# EAGLE design T06_preliminarySchematic_v4 (EAGLE 7.3.0)
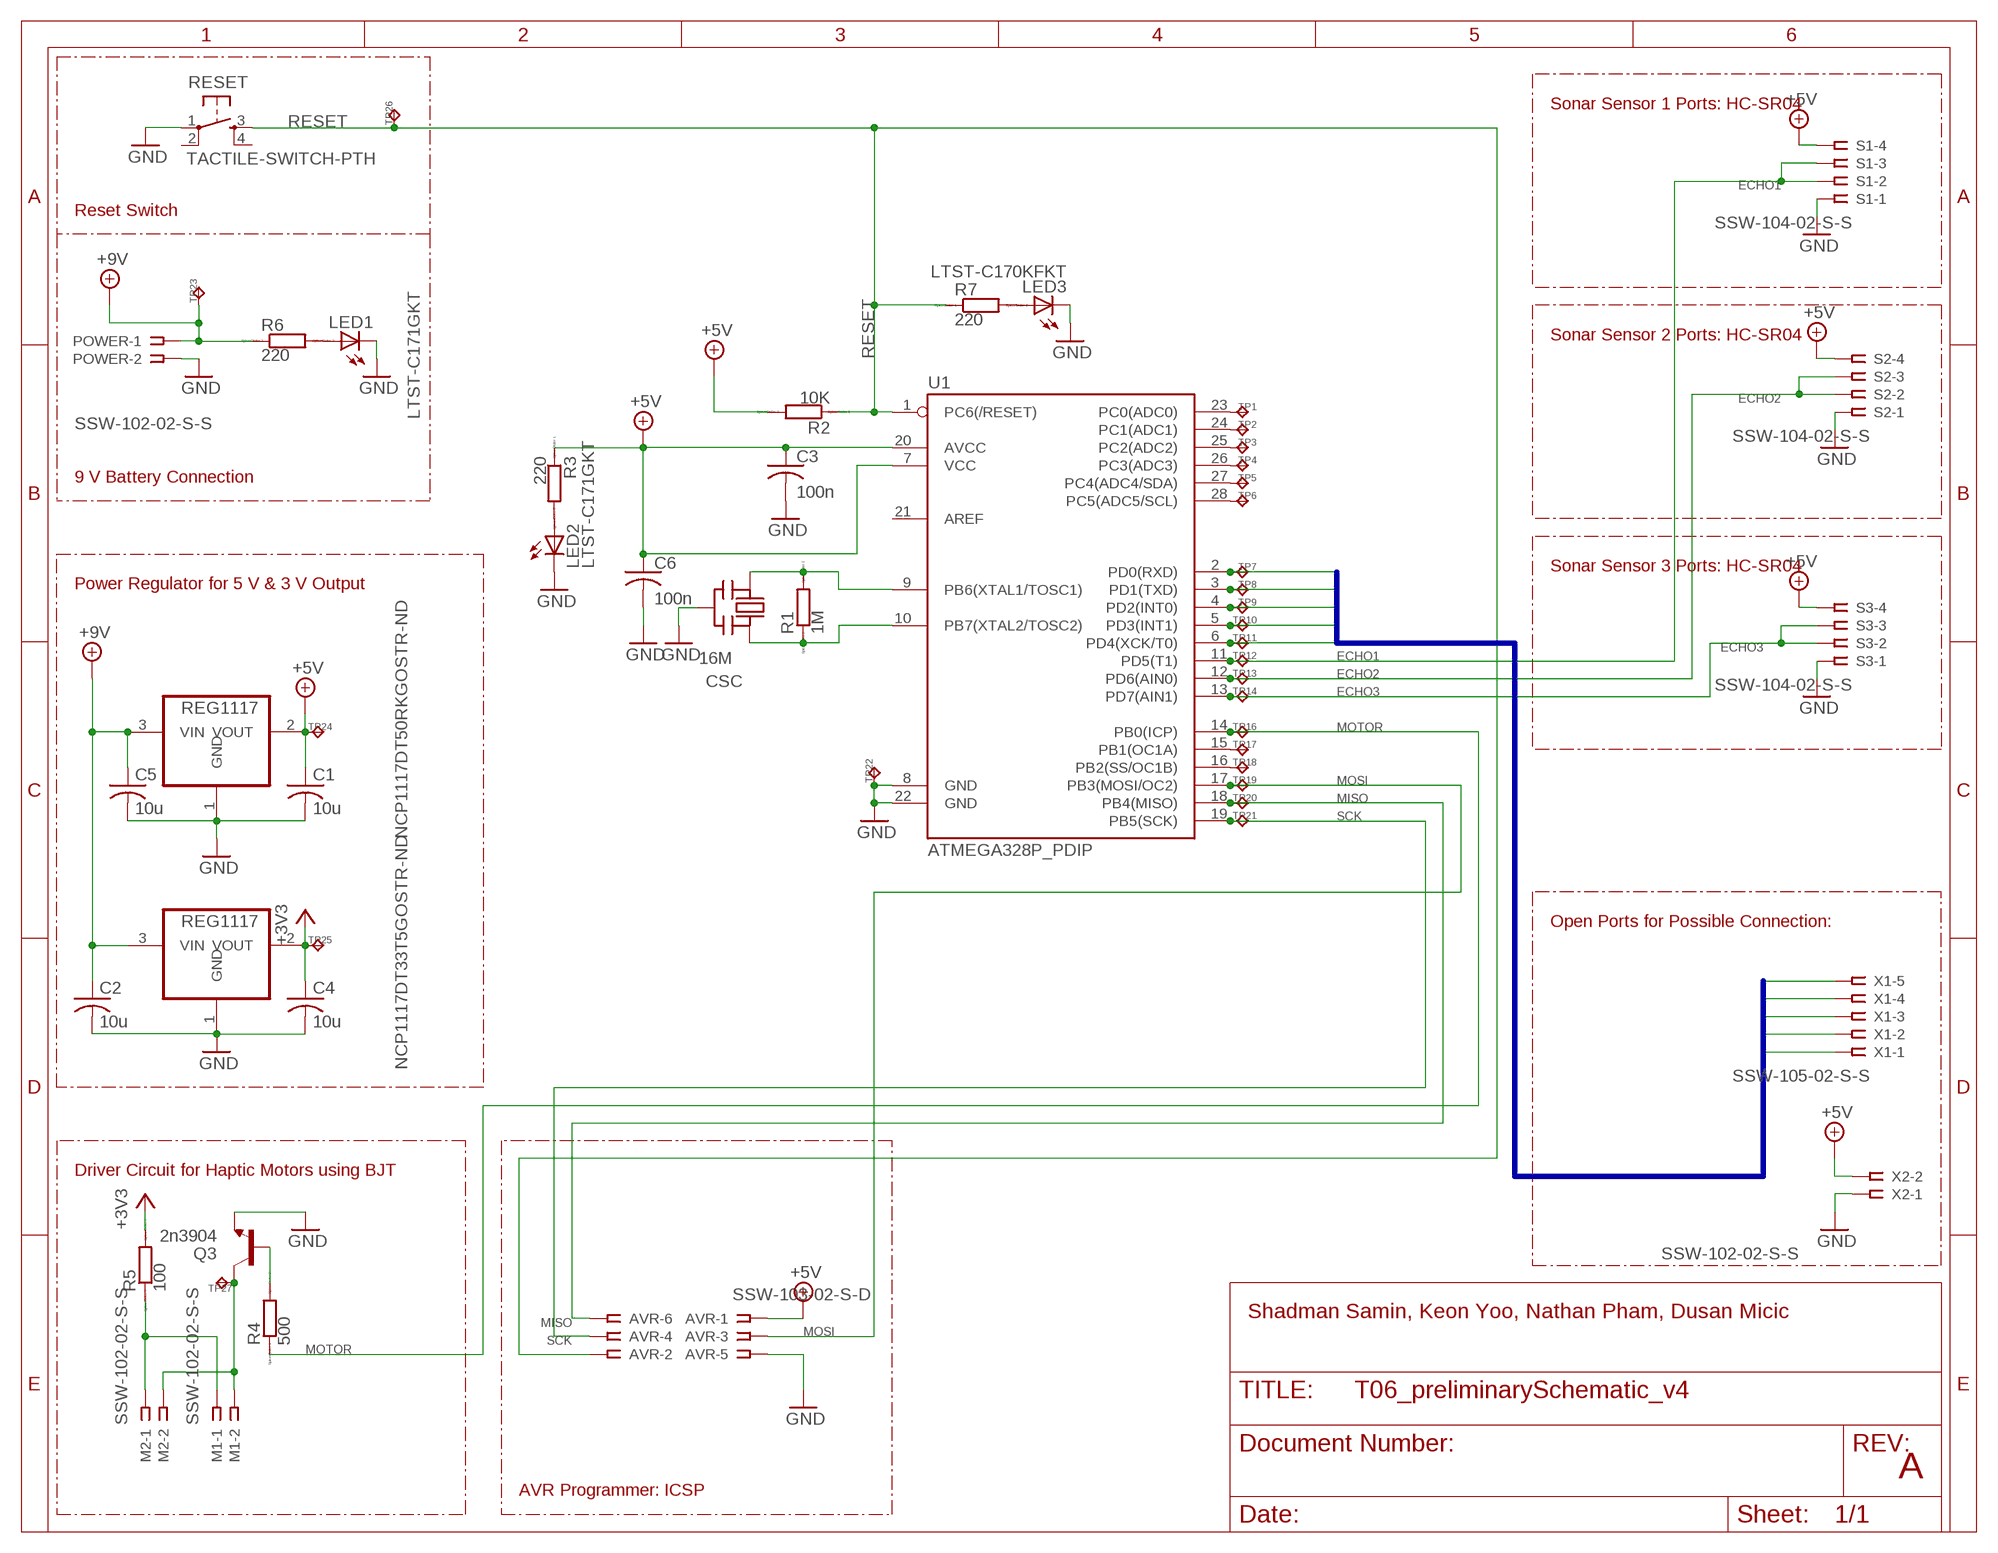
[diagram p0: schematic, sheet 1]

## Parts
AVR  SSW-103-02-S-D  [SSW-103-02-S-D]
C1  10u  C-USC0805K  [C0805K]
C2  10u  C-USC0805K  [C0805K]
C3  100n  C-USC0805K  [C0805K]
C4  10u  C-USC0805K  [C0805K]
C5  10u  C-USC0805K  [C0805K]
C6  100n  C-USC0805K  [C0805K]
CSC  16M  CERMOSCILL-CSTCRG  [CSTCR-G]
LED1  LTST-C171GKT  LEDCHIPLED_0805  [CHIPLED_0805]
LED2  LTST-C171GKT  LEDCHIP-LED0805  [CHIP-LED0805]
LED3  LTST-C170KFKT  LEDCHIP-LED0805  [CHIP-LED0805]
M1  SSW-102-02-S-S  [SSW-102-02-S-S]
M2  SSW-102-02-S-S  [SSW-102-02-S-S]
NCP1117DT33T5GOSTR-ND  REG1117  [SOT223]
NCP1117DT50RKGOSTR-ND  REG1117  [SOT223]
POWER  SSW-102-02-S-S  [SSW-102-02-S-S]
Q3  2n3904  TRANSISTOR_NPN2N3904  [TO-92]
R1  1M  RR0603  [R0603]
R2  10K  RR0603  [R0603]
R3  220  RR0603  [R0603]
R4  500  RR0603  [R0603]
R5  100  RR0603  [R0603]
R6  220  RR0603  [R0603]
R7  220  RR0603  [R0603]
RESET  TACTILE-SWITCH-PTH  [TAC-SWITCH-PTH]
S1  SSW-104-02-S-S  [SSW-104-02-S-S]
S2  SSW-104-02-S-S  [SSW-104-02-S-S]
S3  SSW-104-02-S-S  [SSW-104-02-S-S]
TP1  TPPAD1-13  [P1-13]
TP2  TPPAD1-13  [P1-13]
TP3  TPPAD1-13  [P1-13]
TP4  TPPAD1-13  [P1-13]
TP5  TPPAD1-13  [P1-13]
TP6  TPPAD1-13  [P1-13]
TP7  TPPAD1-13  [P1-13]
TP8  TPPAD1-13  [P1-13]
TP9  TPPAD1-13  [P1-13]
TP10  TPPAD1-13  [P1-13]
TP11  TPPAD1-13  [P1-13]
TP12  TPPAD1-13  [P1-13]
TP13  TPPAD1-13  [P1-13]
TP14  TPPAD1-13  [P1-13]
TP16  TPPAD1-13  [P1-13]
TP17  TPPAD1-13  [P1-13]
TP18  TPPAD1-13  [P1-13]
TP19  TPPAD1-13  [P1-13]
TP20  TPPAD1-13  [P1-13]
TP21  TPPAD1-13  [P1-13]
TP22  TPPAD1-13  [P1-13]
TP23  TPPAD1-13  [P1-13]
TP24  TPPAD1-13  [P1-13]
TP25  TPPAD1-13  [P1-13]
TP26  TPPAD1-13  [P1-13]
TP27  TPPAD1-13  [P1-13]
U1  ATMEGA328P_PDIP  [DIL28-3]
X1  SSW-105-02-S-S  [SSW-105-02-S-S]
X2  SSW-102-02-S-S  [SSW-102-02-S-S]

## Nets
+3V3: C4.1 NCP1117DT33T5GOSTR-ND.2(VOUT) R5.2 TP25.TP
+5V: AVR.1 C1.1 C3.1 C6.1 NCP1117DT50RKGOSTR-ND.2(VOUT) R2.2 R3.1 S1.4 S2.4 S3.4 TP24.TP U1.7(VCC) U1.20(AVCC) X2.2
+9V: C2.1 C5.1 NCP1117DT33T5GOSTR-ND.3(VIN) NCP1117DT50RKGOSTR-ND.3(VIN) POWER.1 R6.1 TP23.TP
BU0: TP7.TP U1.2(PD0(RXD)) X1.1
BU1: TP8.TP U1.3(PD1(TXD)) X1.2
BU2: TP9.TP U1.4(PD2(INT0)) X1.3
BU3: TP10.TP U1.5(PD3(INT1)) X1.4
BU4: TP11.TP U1.6(PD4(XCK/T0)) X1.5
D16: TP18.TP U1.16(PB2(SS/OC1B))
ECHO1: S1.2 S1.3 TP12.TP U1.11(PD5(T1))
ECHO2: S2.2 S2.3 TP13.TP U1.12(PD6(AIN0))
ECHO3: S3.2 S3.3 TP14.TP U1.13(PD7(AIN1))
GND: AVR.5 C1.2 C2.2 C3.2 C4.2 C5.2 C6.2 CSC.2(GND) LED1.C LED2.C LED3.C NCP1117DT33T5GOSTR-ND.1(GND) NCP1117DT50RKGOSTR-ND.1(GND) POWER.2 Q3.1(E) RESET.1 S1.1 S2.1 S3.1 TP22.TP U1.8(GND) U1.22(GND) X2.1
MISO: AVR.6 TP20.TP U1.18(PB4(MISO))
MOSI: AVR.3 TP19.TP U1.17(PB3(MOSI/OC2))
MOTOR: R4.1 TP16.TP U1.14(PB0(ICP))
N$1: CSC.3(OUT) R1.1 U1.10(PB7(XTAL2/TOSC2))
N$2: CSC.1(IN) R1.2 U1.9(PB6(XTAL1/TOSC1))
N$3: TP1.TP U1.23(PC0(ADC0))
N$4: TP2.TP U1.24(PC1(ADC1))
N$5: M1.1 M2.1 R5.1
N$6: TP3.TP U1.25(PC2(ADC2))
N$7: LED1.A R6.2
N$8: LED2.A R3.2
N$9: LED3.A R7.2
N$10: Q3.2(B) R4.2
N$11: M1.2 M2.2 Q3.3(C) TP27.TP
N$12: TP4.TP U1.26(PC3(ADC3))
N$13: TP5.TP U1.27(PC4(ADC4/SDA))
N$14: TP6.TP U1.28(PC5(ADC5/SCL))
N$15: TP17.TP U1.15(PB1(OC1A))
RESET: AVR.2 R2.1 R7.1 RESET.3 TP26.TP U1.1(PC6(/RESET))
SCK: AVR.4 TP21.TP U1.19(PB5(SCK))
Unconnected: RESET.2 RESET.4 U1.21(AREF)

## Buses
BU[0..4]

## Notes on the sheet
- Sonar Sensor 1 Ports: HC-SR04
- Reset Switch
- Sonar Sensor 2 Ports: HC-SR04
- 9 V Battery Connection
- Sonar Sensor 3 Ports: HC-SR04
- Power Regulator for 5 V & 3 V Output
- Open Ports for Possible Connection:
- Driver Circuit for Haptic Motors using BJT
- Shadman Samin, Keon Yoo, Nathan Pham, Dusan Micic
- A
- AVR Programmer: ICSP

## Library data of the parts
AVR = con-samtec:SSW-103-02-S-D: THROUGH-HOLE .025" SQ POST SOCKET Source: Samtec SSW.pdf; MPN: SSW-103-02-S-D; OC_FARNELL: unknown; OC_NEWARK: 11P9365
C1 C2 C4 C5 = adafruit:C-US: CAPACITOR, American symbol
C3 C6 = rcl:C-US: CAPACITOR, American symbol
CSC = adafruit:CERMOSCILL: Ceramic oscillator with built in capacitors such as ZTT-12MHz http://www.ladyada.net/library/eagle
LED1-LED3 = adafruit:LED: LED OSRAM: - CHIPLED LG R971, LG N971, LY N971, LG Q971, LY Q971, LO R971, LY R971 LH N974, LH R974 LS Q976, LO Q976, LY Q976 LO Q996 - Hyper CHIPLED LW Q18S LB Q993, LB Q99A, LB R99A - SideLED LS A670, LO A670, LY A670, LG A670, LP A670 LB A673, LV A673, LT A673, LW A673 LH A674 LY A675 LS A676, LA A676, LO A676, LY A676, LW A676 LS A679, LY A679, LG A679 - Hyper Micro SIDELED® LS Y876, LA Y876, LO Y876, LY Y876 LT Y87S - SmartLED LW L88C, LW L88S LB L89C, LB L89S, LG L890 LS L89K, LO L89K, LY L89K LS L896, LA L896, LO L896, LY L896 - TOPLED LS T670, LO T670, LY T670, LG T670, LP T670 LSG T670, LSP T670, LSY T670, LOP T670, LYG T670 LG T671, LOG T671, LSG T671 LB T673, LV T673, LT T673, LW T673 LH T674 LS T676, LA T676, LO T676, LY T676, LB T676, LH T676, LSB T676, LW T676 LB T67C, LV T67C, LT T67C, LS T67K, LO T67K, LY T67K, LW E67C LS E67B, LA E67B, LO E67B, LY E67B, LB E67C, LV E67C, LT E67C LW T67C LS T679, LY T679, LG T679 LS T770, LO T770, LY T770, LG T770, LP T770 LB T773, LV T773, LT T773, LW T773 LH T774 LS E675, LA E675, LY E675, LS T675 LS T776, LA T776, LO T776, LY T776, LB T776 LHGB T686 LT T68C, LB T68C - Hyper Mini TOPLED® LB M676 - Mini TOPLED Santana® LG M470 LS M47K, LO M47K, LY M47K Source: http://www.osram.convergy.de/
M1 M2 POWER X2 = con-samtec:SSW-102-02-S-S: THROUGH-HOLE .025" SQ POST SOCKET Source: Samtec SSW.pdf; MPN: SSW-102-02-S-S; OC_FARNELL: unknown; OC_NEWARK: 11P9351
NCP1117DT33T5GOSTR-ND NCP1117DT50RKGOSTR-ND = burr-brown:REG1117: 800mA and 1A Low Dropout (LDO) Positive Regulator 1.8V, 2.5V, 2.85V, 3.3V, 5V, and Adj; MPN: REG1117; OC_FARNELL: 1097566; OC_NEWARK: 14P6981
Q3 = SparkFun-DiscreteSemi:TRANSISTOR_NPN: Generic NPN BJT MMBT2222A - TRANS-08049 (SOT-23, 1A 40V) MPSA42 - TRANS-09116 (SOT-23, 500mA 300V) MMBT5088LT1G - TRANS-11160 (SOT-23, 50 mA 30V) BC547 - COM-08928 <http://www.sparkfun.com/products/8928> (TO-92 45V 100mA) (1.Collector 2.Base 3.Emitter) 2N3904 - COM-00521 <http://www.sparkfun.com/products/521> (TO-92 40V 200mA) (1.Emitter 2.Base 3.Collector) P2N2222A - COM-12852 <http://www.sparkfun.com/products/12852> (TO-92 40V 600mA) (1.Collector 2.Base 3.Emitter); PROD_ID: TRANS-08447
R1-R7 = eagle-ltspice:R: RESISTOR, European symbol; SPICEMODEL: NONE; SPICEPREFIX: R
RESET = GeekAmmo:TACTILE-SWITCH: Tactile Switch 4 Pins, SPST NO
S1-S3 = con-samtec:SSW-104-02-S-S: THROUGH-HOLE .025" SQ POST SOCKET Source: Samtec SSW.pdf; MPN: SSW-104-02-S-S; OC_FARNELL: unknown; OC_NEWARK: 11P9384
TP1-TP14 TP16-TP27 = testpad:TP: Test pad
U1 = SparkFun-DigitalIC:ATMEGA328P_PDIP: uC used in the Arduino 32kb flash, 1k EEPROM, 2k SRAM This is the through-hole version of this chip.
X1 = con-samtec:SSW-105-02-S-S: THROUGH-HOLE .025" SQ POST SOCKET Source: Samtec SSW.pdf; MPN: SSW-105-02-S-S; OC_FARNELL: unknown; OC_NEWARK: 11P9399

## Net classes
0 default: width 0.305 mm, drill 0.508 mm, clearance 0.254 mm

## Board
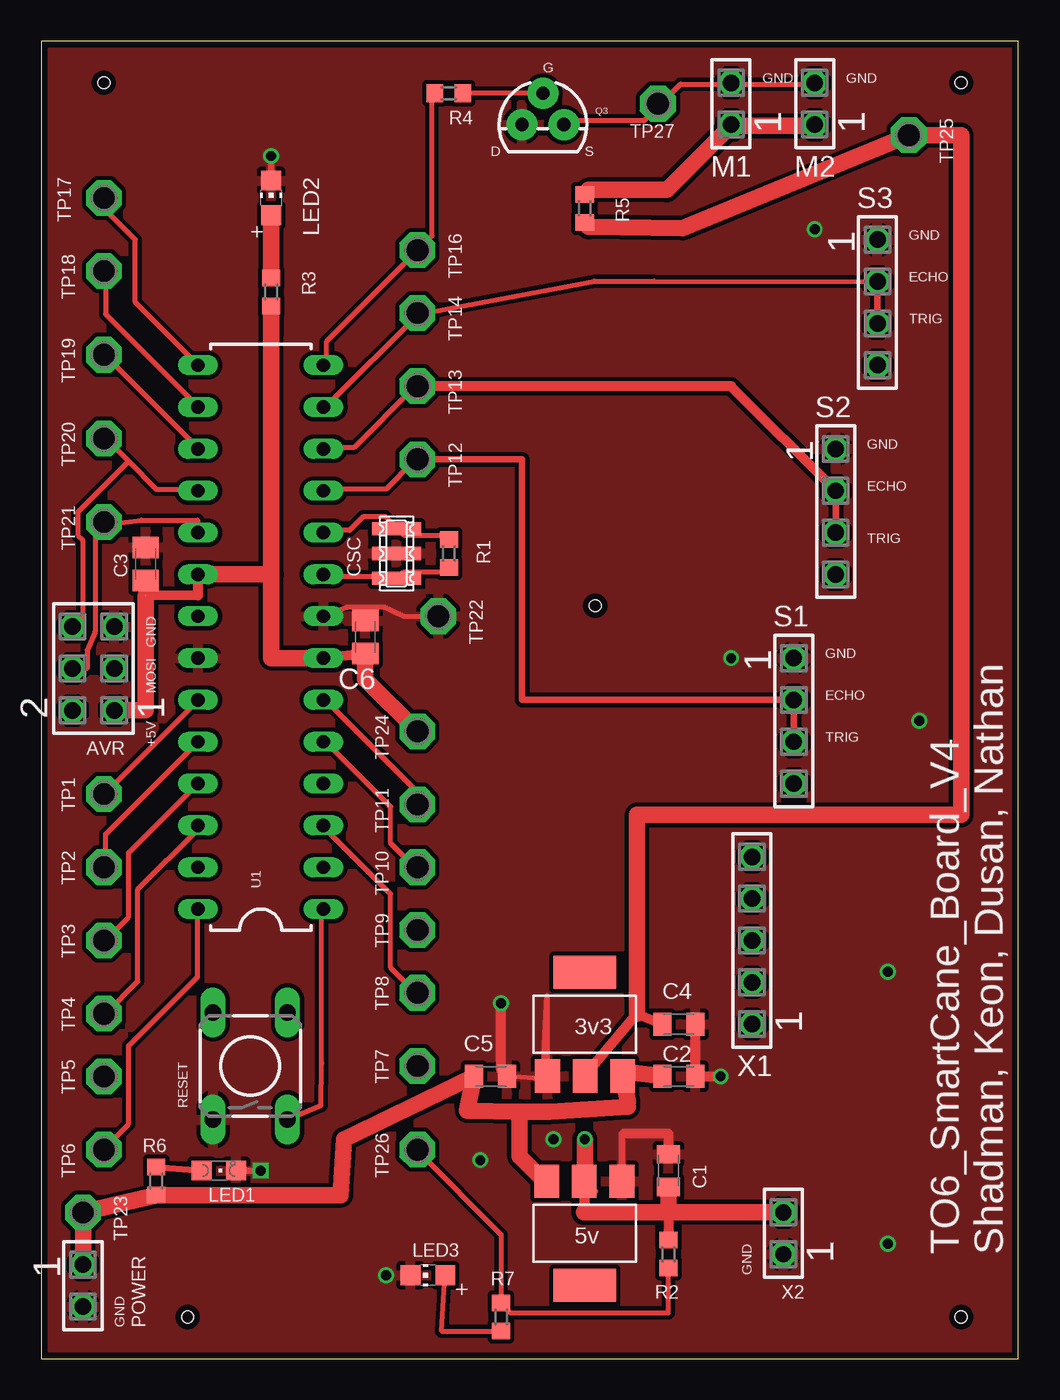
[diagram p1: board, top side]
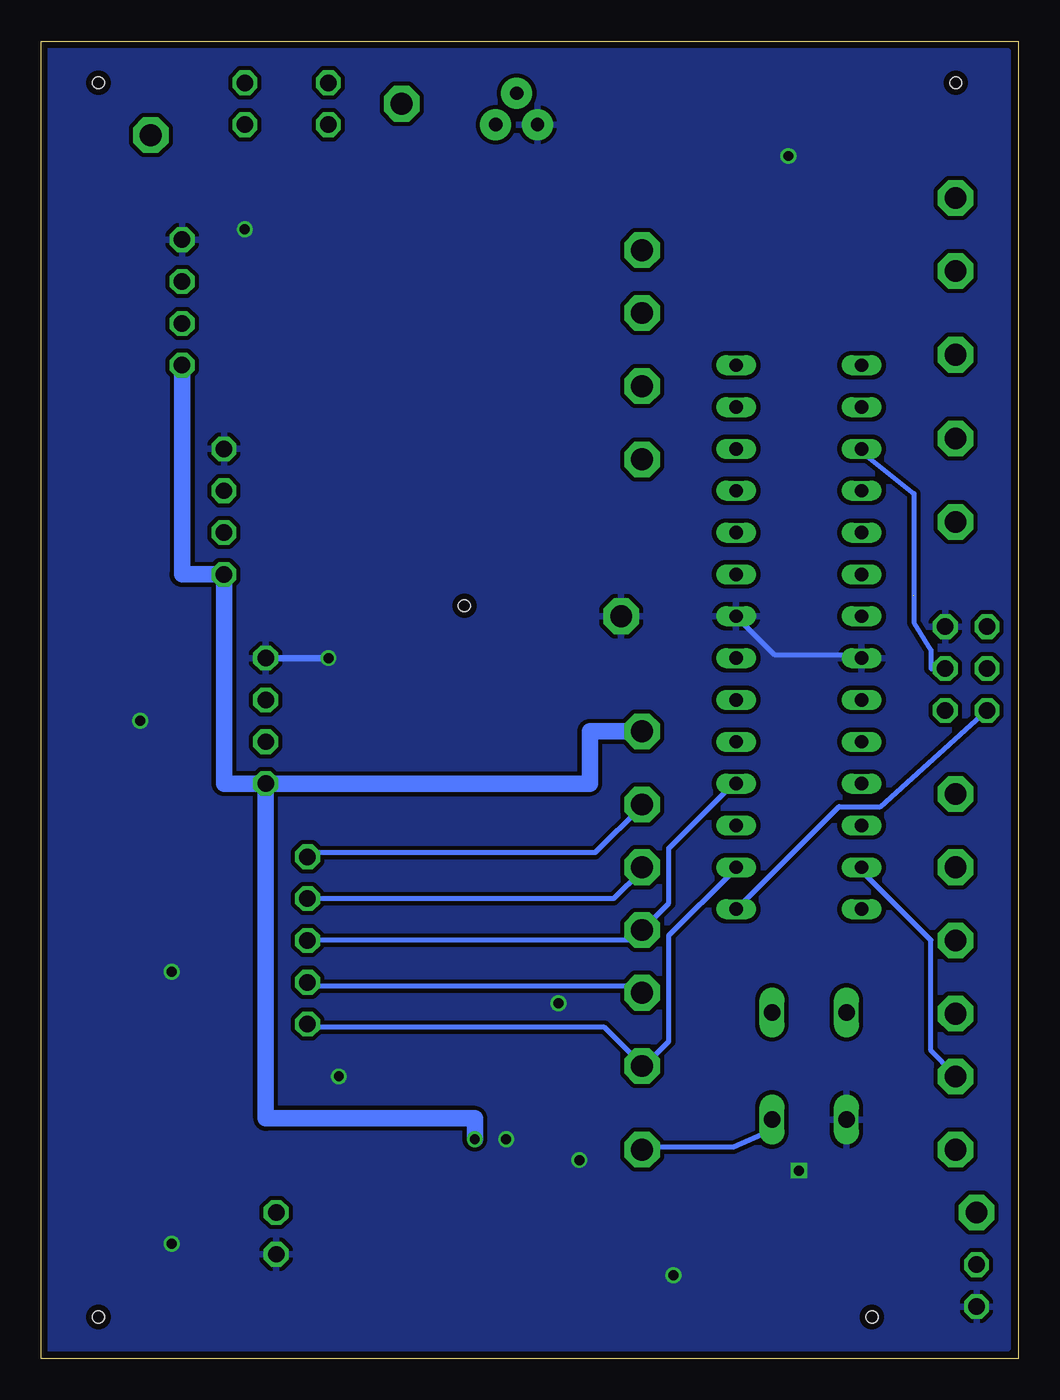
[diagram p2: board, bottom side, seen from below]

Size 59.36 x 80 mm. Coordinates in mm from the lower left corner, seen from the top.
Outline: 0,0 59.36,0 59.36,80 0,80 0,0
Copper layers (1*16): Top 0.0356mm / dielectric 1.5011mm / Bottom 0.0356mm
Design rules "LaenPCBOrder": minimum track width 6mil, minimum drill 13mil, track to track 6mil, track to pad 6mil, pad to pad 6mil, via to via 6mil, smd to smd 6mil, copper to edge 15mil, drill to drill 6mil, minimum pad ring 7mil, minimum via ring 7mil, stop-mask expansion 3mil, vias tented up to drill 0mil, thermal gap 10mil
Holes 0.7 mm at 55.88,2.54 8.89,2.54 3.81,77.47 55.88,77.47 33.66,45.72

### Footprints (pad centres in the part's own frame; a part is rotated, then mirrored left to right if it is on the bottom)
SSW-103-02-S-D = drill 1 pad 1.5 octagon: 1 -2.54,-1.27; 2 -2.54,1.27; 3 0,-1.27; 4 0,1.27; 5 2.54,-1.27; 6 2.54,1.27
C0805K = smd 1.1 x 1.4: 1 -1,0; 2 1,0
C0805K' = smd 1.3 x 1.6: 1 -1,0; 2 1,0
CSTCR-G = smd 0.8 x 3: 1 -1.5,0; 2 0,0; 3 1.5,0
CHIPLED_0805 = smd 1.2 x 1.2: A 0,-1.05; C 0,1.05
CHIP-LED0805 = smd 1.2 x 1.2: A 0,-1.05; C 0,1.05
SSW-102-02-S-S = drill 1 pad 1.5 octagon: 1 -1.27,0; 2 1.27,0
SOT223 = smd 1.499 x 2.007: 1 -2.261,-3.15; 2 0.025,-3.15; 3 2.311,-3.15 | smd 3.81 x 2.007: 4 0,3.15
TO-92 = drill 0.813 pad 1.88: 1 -1.27,0; 2 0,1.905; 3 1.27,0
R0603 = smd 1 x 1.1: 1 -0.85,0; 2 0.85,0
TAC-SWITCH-PTH = drill 1.016 pad 1.524 long: 1 -3.251,2.261; 2 3.251,2.261; 3 -3.251,-2.261; 4 3.251,-2.261
SSW-104-02-S-S = drill 1 pad 1.5 octagon: 1 -3.81,0; 2 -1.27,0; 3 1.27,0; 4 3.81,0
P1-13 = drill 1.321 pad 2.159 octagon: TP 0,0
DIL28-3 = drill 0.813 long: 1 -16.51,-3.81; 2 -13.97,-3.81; 3 -11.43,-3.81; 4 -8.89,-3.81; 5 -6.35,-3.81; 6 -3.81,-3.81; 7 -1.27,-3.81; 8 1.27,-3.81; 9 3.81,-3.81; 10 6.35,-3.81; 11 8.89,-3.81; 12 11.43,-3.81; 13 13.97,-3.81; 14 16.51,-3.81; 15 16.51,3.81; 16 13.97,3.81; 17 11.43,3.81; 18 8.89,3.81; 19 6.35,3.81; 20 3.81,3.81; 21 1.27,3.81; 22 -1.27,3.81; 23 -3.81,3.81; 24 -6.35,3.81; 25 -8.89,3.81; 26 -11.43,3.81; 27 -13.97,3.81; 28 -16.51,3.81
SSW-105-02-S-S = drill 1 pad 1.5 octagon: 1 -5.08,0; 2 -2.54,0; 3 0,0; 4 2.54,0; 5 5.08,0

### Placement (x,y rotation side)
AVR  3.17,41.91 90 top
C1  38.1,11.43 90 top
C2  38.73,17.14 0 top
C3  100n  [C0805K']  6.35,48.26 90 top
C4  38.73,20.32 0 top
C5  27.3,17.14 0 top
C6  100n  [C0805K']  19.68,43.81 90 top
CSC  21.59,48.9 90 top
LED1  10.79,11.43 270 top
LED2  13.97,70.48 0 top
LED3  23.5,5.08 90 top
M1  41.91,76.2 90 top
M2  46.99,76.2 90 top
NCP1117DT33T5GOSTR-ND  33.02,20.32 0 top
NCP1117DT50RKGOSTR-ND  33.02,7.62 180 top
POWER  2.54,4.45 270 top
Q3  30.48,74.93 0 top
R1  24.77,48.9 270 top
R2  38.1,6.35 90 top
R3  13.97,64.77 90 top
R4  24.77,76.83 0 top
R5  33.02,69.85 270 top
R6  6.99,10.79 90 top
R7  27.94,2.54 270 top
RESET  12.7,17.78 90 top
S1  45.72,38.73 270 top
S2  48.26,51.44 270 top
S3  50.8,64.14 270 top
TP1  3.81,34.29 180 top
TP2  3.81,29.84 180 top
TP3  3.81,25.4 180 top
TP4  3.81,20.95 180 top
TP5  3.81,17.14 180 top
TP6  3.81,12.7 180 top
TP7  22.86,17.78 180 top
TP8  22.86,22.23 180 top
TP9  22.86,26.04 180 top
TP10  22.86,29.84 180 top
TP11  22.86,33.66 180 top
TP12  22.86,54.61 180 top
TP13  22.86,59.05 180 top
TP14  22.86,63.5 180 top
TP16  22.86,67.31 180 top
TP17  3.81,70.48 90 top
TP18  3.81,66.04 180 top
TP19  3.81,60.96 180 top
TP20  3.81,55.88 180 top
TP21  3.81,50.8 180 top
TP22  24.13,45.09 180 top
TP23  2.54,8.89 180 top
TP24  22.86,38.1 180 top
TP25  52.7,74.3 180 top
TP26  22.86,12.7 180 top
TP27  37.47,76.2 180 top
U1  13.34,43.81 90 top
X1  43.18,25.4 90 top
X2  45.09,7.62 90 top

### Tracks (layer width: path | path; a pad name or v marks a point on that pad's centre or on a via)
+3V3
  Top 0.305: 33.25,68.73 R5.2
  Top 0.61: NCP1117DT33T5GOSTR-ND.2 33.02,17.2 36.2,20.95 C4.1
  Top 1.016: 33.25,68.73 38.96,68.66 TP25.TP 55.88,74.3 55.88,33.02 36.2,33.02 36.2,20.95
+5V  (via drill 0.6 pad 0.61)  (1 unrouted)
  Top 0.305: 32.97,10.62 NCP1117DT50RKGOSTR-ND.2
  Top 0.406: 6.35,46.99 6.36,46.34 | NCP1117DT50RKGOSTR-ND.2 33.6,10.16 33.66,10.16 33.02,10.79
  Top 0.61: 38.1,8.89 R2.2 | 32.97,10.62 32.97,8.89 | NCP1117DT50RKGOSTR-ND.2 32.99,8.89 | 6.36,46.34 9.53,46.35 U1.20 | C3.1 6.35,46.99 | C6.1 U1.7
  Top 0.813: 6.35,46.35 6.36,43.19
  Top 1.016: C1.1 38.1,8.89 | 32.97,8.89 32.99,8.89 38.1,8.89 | X2.2 38.1,8.89 | 33.02,10.79 v33.02,13.34 | TP24.TP 19.68,41.27 C6.1 | U1.7 13.97,42.55 13.97,47.62 | 13.97,47.62 U1.20 | 6.36,46.34 6.35,46.33 6.35,39.37 AVR.1 | 13.97,47.62 13.97,62.23 13.97,62.87 R3.1
  Bottom 1.016: v33.02,13.34 33.02,14.61 45.72,14.61 S1.4 | S1.4 48.26,34.92 S2.4 50.8,47.62 S3.4 | S1.4 26.04,34.92 26.04,38.1 TP24.TP
+9V
  Top 0.305: 30.45,10.9 NCP1117DT50RKGOSTR-ND.3 | 35.64,15.29 35.64,15.57
  Top 0.406: NCP1117DT33T5GOSTR-ND.3 35.53,17.41
  Top 1.016: 29.06,15.01 29.06,12.29 30.45,10.9 | 29.06,15.01 25.88,15.06 C5.1 18.41,13.34 18.2,9.95 R6.1 TP23.TP POWER.1 | 35.64,15.57 NCP1117DT33T5GOSTR-ND.3 | 35.64,15.29 30.91,15.01 29.06,15.01 | 35.53,17.41 C2.1
BU0
  Bottom 0.305: U1.2 17.32,29.62 21.23,25.7 21.23,19.28 22.63,17.88 TP7.TP 22.91,17.88 25.15,20.12 43.08,20.12 X1.1
BU1
  Top 0.305: U1.3 17.32,32.13 21.23,28.22 21.23,23.75 22.63,22.35 TP8.TP
  Bottom 0.305: X1.2 43.08,22.63 23.19,22.63 22.91,22.35 TP8.TP
BU2
  Bottom 0.305: U1.4 17.32,34.92 21.23,31.01 21.23,27.66 TP9.TP 23.47,25.43 43.71,25.43 X1.3
BU3
  Top 0.305: U1.5 17.32,37.44 21.23,33.53 21.23,31.29 22.63,29.9 TP10.TP
  Bottom 0.305: X1.4 24.59,27.94 22.91,29.62 TP10.TP
BU4
  Top 0.305: U1.6 17.32,39.95 22.63,34.65 22.63,33.81 TP11.TP
  Bottom 0.305: X1.5 43.08,30.73 25.7,30.73 22.91,33.53 TP11.TP
D16
  Top 0.305: U1.16 9.5,57.84 3.91,63.42 3.91,65.94 TP18.TP
ECHO1
  Top 0.305: U1.11 17.32,52.81 20.95,52.81 22.63,54.48 TP12.TP
  Top 0.406: TP12.TP 29.21,54.61 29.21,40.01 S1.2 S1.3
ECHO2
  Top 0.305: U1.12 17.32,55.32 19,55.32 22.63,58.95 TP13.TP
  Top 0.406: S2.2 S2.3
  Top 0.61: S2.2 41.91,59.05 TP13.TP
ECHO3
  Top 0.305: 22.91,63.42 17.32,57.84 U1.13 | 22.91,63.42 33.6,65.43 37.24,65.43 S3.2 | 22.91,63.42 TP14.TP
  Top 0.406: S3.2 S3.3
GND  (via drill 0.6)
  Top 0.305: 35.48,10.9 NCP1117DT50RKGOSTR-ND.1 | CSC.2 20.34,48.9 | 6.4,48.74 C3.2 | 23.85,45.09 24.38,45.19 | NCP1117DT33T5GOSTR-ND.1 30.73,17.32 30.73,22.07 30.45,16.64 31.09,16.69 30.73,16.97 C5.2 | U1.8 18.59,45.62 20.83,45.62 22,45.09 23.85,45.09 | 23.85,45.09 TP22.TP
  Top 0.406: LED1.C v13.34,11.43 | LED2.C v13.97,73.03 | 35.42,13.69 35.28,13.69 NCP1117DT50RKGOSTR-ND.1
  Top 0.61: 35.42,13.69 38.1,13.69 C1.2 | v41.27,17.14 C2.2 C4.2 | C5.2 27.94,17.51 v27.94,21.59
  Bottom 0.305: 10.62,15.09 RESET.1 | U1.8 14.81,42.75 9.78,42.75 U1.22
  Bottom 0.406: v41.91,42.55 S1.1
  other vias: 20.95,5.08 53.34,38.73 51.44,23.5 51.44,6.99 46.99,68.58 26.67,12.06 31.11,13.34
  pour Bottom (isolate 0.254): 0.64,79.38 59.05,79.38 59.05,0.64 0.64,0.64
  pour Top (isolate 0.254): 0.64,79.38 59.05,79.38 59.05,0.64 0.64,0.64
MISO
  Top 0.305: 5.31,54.48 3.91,55.88 TP20.TP | 5.31,54.48 6.99,52.81 9.5,52.81 U1.18 | 5.31,54.48 2.23,51.41 2.23,50.01 2.52,49.73 2.52,44.7 AVR.6
MOSI
  Top 0.305: U1.17 9.5,55.32 3.91,60.91 TP19.TP
  Bottom 0.305: AVR.3 5.31,41.91 5.31,43.03 6.35,44.7 6.35,52.53 9.5,55.04 U1.17
MOTOR
  Top 0.305: R4.1 23.75,76.83 23.75,68.17 22.91,67.33 TP16.TP 22.63,67.06 17.32,61.75 17.32,60.35 U1.14
N$1
  Top 0.305: R1.1 24.54,50.01 22.02,50.01 21.74,50.29 CSC.3 21.46,50.57 20.9,51.13 19.56,51.13 18.72,50.29 17.32,50.29 U1.10
N$2
  Top 0.305: R1.2 24.54,47.78 22.02,47.78 21.74,47.5 CSC.1 21.46,47.5 17.32,47.5 U1.9
N$3
  Top 0.305: U1.23 9.5,39.95 3.91,34.37 TP1.TP
N$4
  Top 0.305: U1.24 3.91,31.85 3.91,29.9 TP2.TP
N$5
  Top 0.305: 33.25,70.97 R5.1 | 46.94,74.88 M2.1 | 41.91,74.88 M1.1
  Top 1.016: 33.25,70.97 38,70.97 41.91,74.88 46.94,74.88
N$6
  Top 0.305: U1.25 9.5,34.92 5.31,30.73 5.31,26.82 3.91,25.43 TP3.TP
N$7
  Top 0.406: LED1.A R6.2
N$8
  Top 1.016: R3.2 LED2.A
N$9
  Top 0.305: R7.2 27.94,1.68 24.33,1.68 LED3.A
N$10
  Top 0.305: Q3.2 R4.2
N$11
  Top 0.305: 41.91,77.39 38.84,77.39 37.72,76.28 TP27.TP 37.44,76 36.6,75.16 31.85,75.16 Q3.3 | 41.91,77.39 46.94,77.39 M2.2 | 41.91,77.39 M1.2
N$12
  Top 0.305: U1.26 9.5,32.13 5.87,28.5 5.87,22.91 3.91,20.95 TP4.TP
N$13
  Bottom 0.305: U1.27 9.5,29.62 5.31,25.43 5.31,18.72 3.91,17.32 TP5.TP
N$14
  Top 0.305: U1.28 9.5,27.1 9.5,23.19 5.31,19 5.31,14.25 3.91,12.85 TP6.TP
N$15
  Top 0.305: U1.15 5.71,64.14 5.71,67.94 3.81,69.85 TP17.TP
RESET
  Top 0.305: TP26.TP 22.91,12.57 27.94,7.54 R7.1 27.94,3.35 28.5,2.79 38.1,2.79 R2.1 | U1.1 17.04,27.1 17.04,17.96 16.99,15.37 RESET.3
  Bottom 0.305: AVR.2 8.38,33.53 10.9,33.53 17.04,27.38 U1.1 | TP26.TP 22.63,12.85 17.32,12.85 15.09,13.82 RESET.3
SCK
  Top 0.305: 3.28,50.57 6.1,50.93 9.5,50.93 U1.19 | 3.28,50.57 3.28,44.15 2.79,43.03 2.79,41.91 AVR.4 | 3.28,50.57 TP21.TP

### Text on the board
tPlace: TO6_SmartCane_Board_V4 / Shadman, Keon, Dusan, Nathan
tNames: G | GND | GND | D | S | GND | ECHO | TRIG | GND | ECHO | TRIG | GND | MOSI | GND | ECHO | +5V | TRIG | 3v3 | 5v | GND | GND